# EAGLE design Spring12_6_daughterboard (EAGLE 6.1)
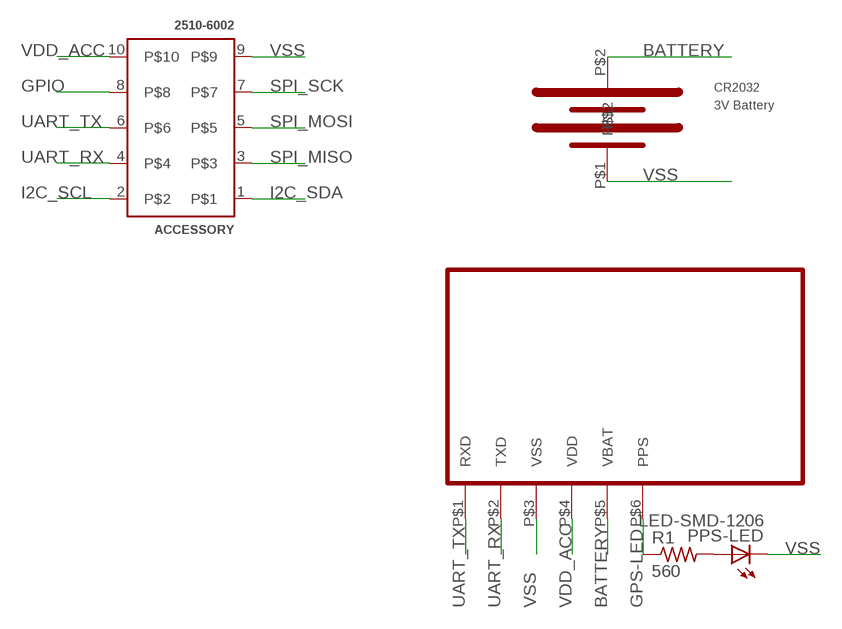
[diagram p0: schematic, sheet 1]

## Parts
ACCESSORY  2510-6002  [2510-6002]
PPS-LED  LED-SMD-1206  [LED1206]
R1  560  R-US_R1206  [R1206]
U$1  796136-1-CR2302_HOLDER  [796136-1-CR2032_HOLDER]
U$3  GPS-UP501  [GPS-UP501]

## Nets
BATTERY: U$1.P$2 U$3.P$5(VBAT)
GPIO: ACCESSORY.8
GPS-LED: R1.1 U$3.P$6(PPS)
I2C_SCL: ACCESSORY.2
I2C_SDA: ACCESSORY.1
N$1: PPS-LED.A R1.2
SPI_MISO: ACCESSORY.3
SPI_MOSI: ACCESSORY.5
SPI_SCK: ACCESSORY.7
UART_RX: ACCESSORY.4 U$3.P$2(TXD)
UART_TX: ACCESSORY.6 U$3.P$1(RXD)
VDD_ACC: ACCESSORY.10 U$3.P$4(VDD)
VSS: ACCESSORY.9 PPS-LED.C U$1.P$1 U$3.P$3(VSS)

## Library data of the parts
ACCESSORY = 4534_I2C2:2510-6002: 3M 2510-6002 Walled Header
PPS-LED = 4534_I2C2:LED-SMD-1206: 160-1169-1-ND
R1 = rcl:R-US_: RESISTOR, American symbol
U$1 = 4534_Node_Board:796136-1-CR2302_HOLDER
U$3 = 4534_Node_Board:GPS-UP501

## Board
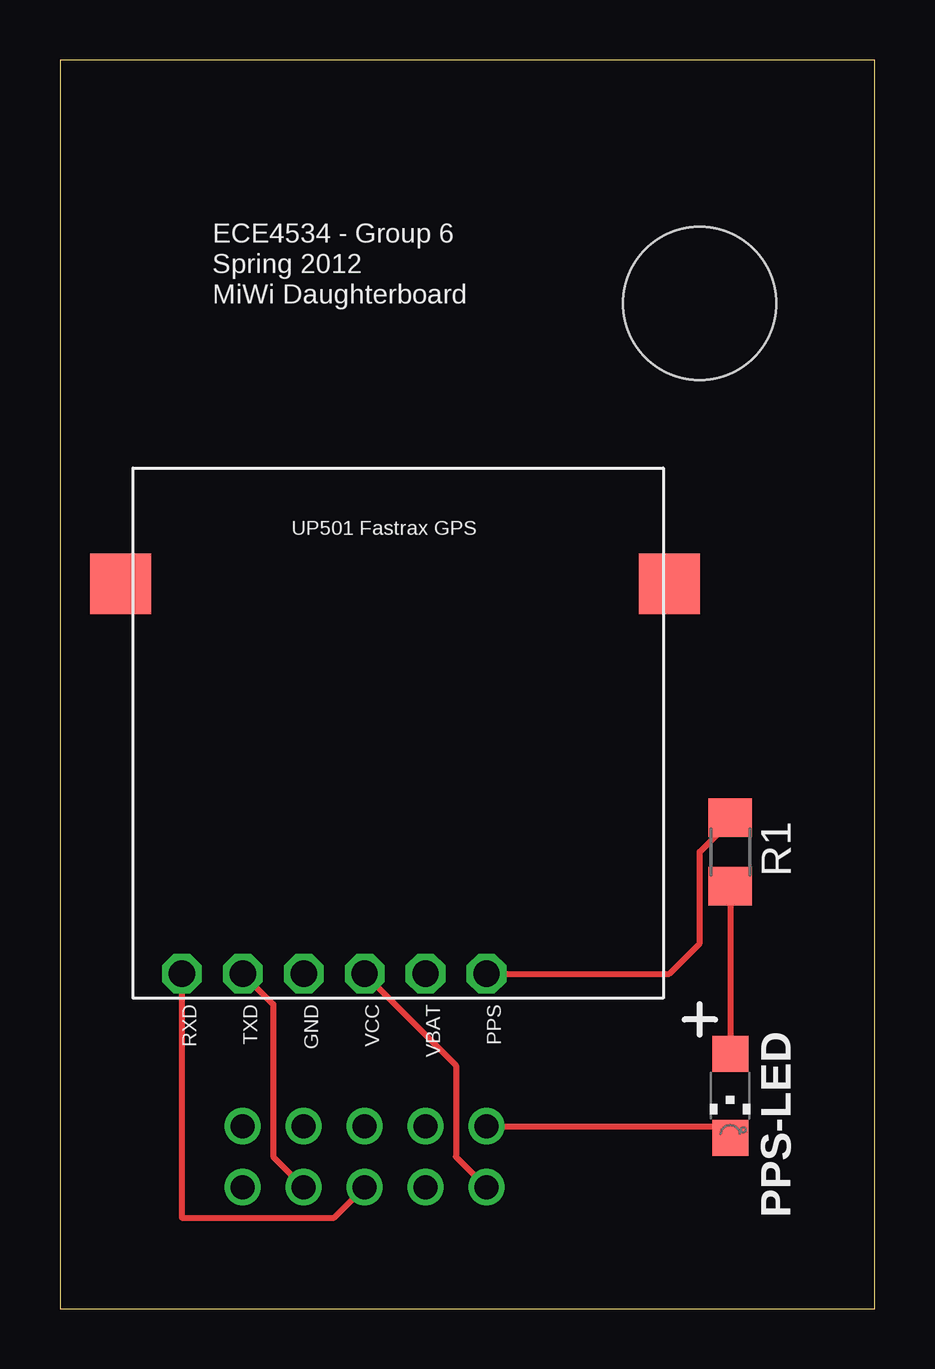
[diagram p1: board, top side]
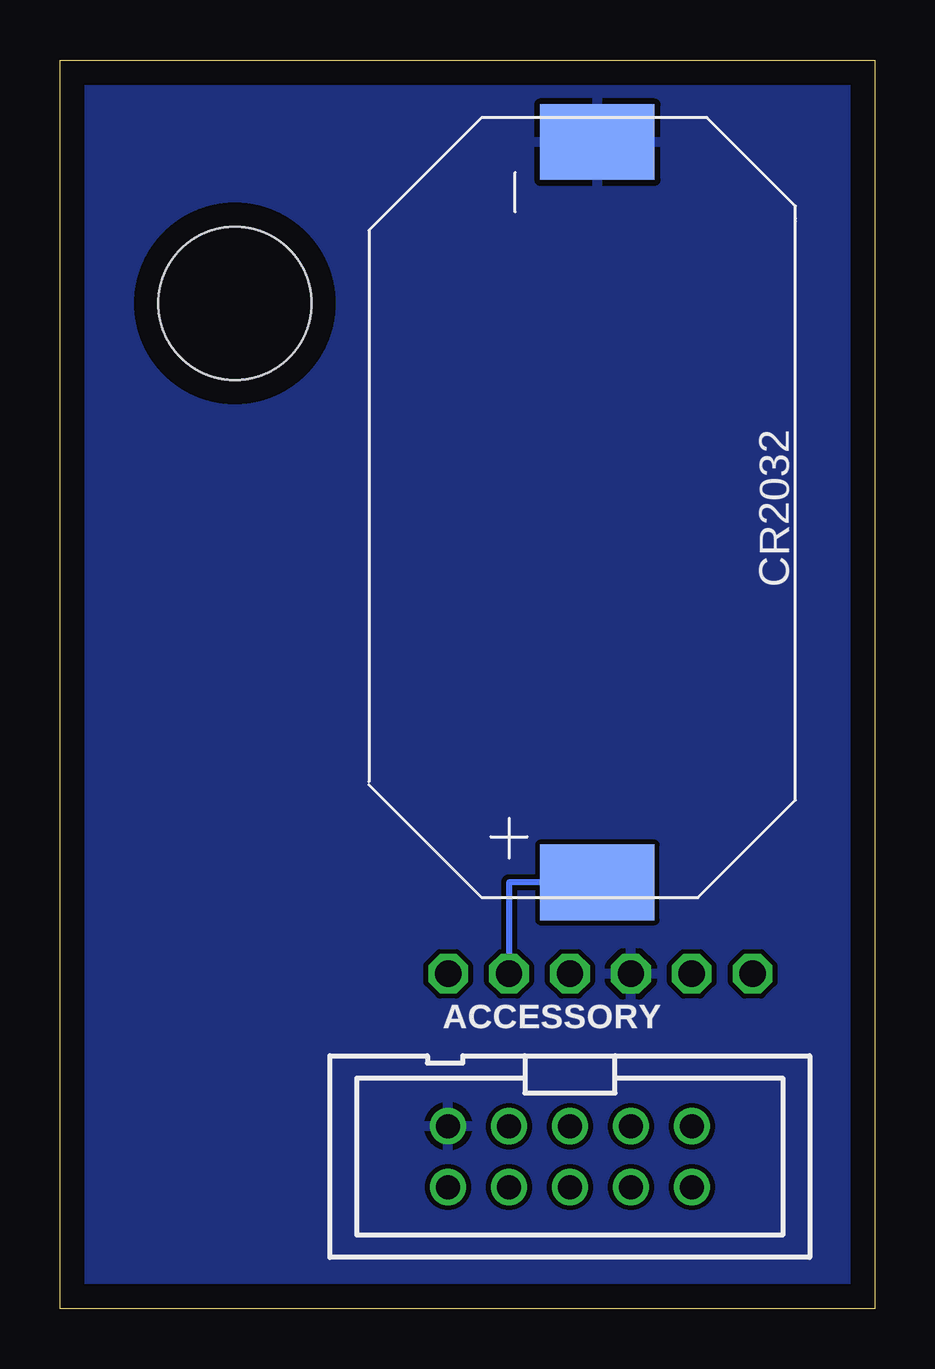
[diagram p2: board, bottom side, seen from below]

Size 33.96 x 52.06 mm. Coordinates in mm from the lower left corner, seen from the top.
Outline: 0,0 33.96,0 33.96,52.06 0,52.06 0,0
Copper layers (1*16): Top 0.035mm / dielectric 1.5mm / Bottom 0.035mm
Design rules: minimum track width 10mil, minimum drill 24mil, track to track 8mil, track to pad 8mil, pad to pad 8mil, via to via 8mil, smd to smd 8mil, copper to edge 40mil, drill to drill 8mil, minimum pad ring 10mil, minimum via ring 8mil, stop-mask expansion 4mil, vias tented up to drill 0mil, thermal gap 10mil
Holes 6.38 mm at 26.67,41.91
tRestrict: area 3.8,15.2 to 25.4,35.6

### Footprints (pad centres in the part's own frame; a part is rotated, then mirrored left to right if it is on the bottom)
2510-6002 = drill 1 pad 1.422: 1 -5.08,-1.27; 2 -5.08,1.27; 3 -2.54,-1.27; 4 -2.54,1.27; 5 0,-1.27; 6 0,1.27; 7 2.54,-1.27; 8 2.54,1.27; 9 5.08,-1.27; 10 5.08,1.27
LED1206 = smd 1.5 x 1.5: A 0,-1.75; C 0,1.75
R1206 = smd 1.6 x 1.803: 1 -1.422,0; 2 1.422,0
796136-1-CR2032_HOLDER = smd 3.15 x 4.775: P$1 20.701,-2.413; P$2 -10.16,-2.413
GPS-UP501 = drill 1.1 octagon: P$1 -7.62,-6.35; P$2 -5.08,-6.35; P$3 -2.54,-6.35; P$4 0,-6.35; P$5 2.54,-6.35; P$6 5.08,-6.35 | smd 2.54 x 2.54: P$7 -10.16,9.906; P$8 12.7,9.906

### Placement (x,y rotation side)
ACCESSORY  12.7,6.35 180 bottom
PPS-LED  27.94,8.89 180 top
R1  27.94,19.05 270 top
U$1  13.97,27.94 90 bottom
U$3  12.7,20.32 0 top

### Tracks (layer width: path | path; a pad name or v marks a point on that pad's centre or on a via)
BATTERY
  Bottom 0.254: U$3.P$5 15.24,17.78 U$1.P$2
GPS-LED
  Top 0.254: U$3.P$6 25.4,13.97 26.67,15.24 26.67,19.05 27.94,20.32 R1.1
N$1
  Top 0.254: 27.94,10.16 PPS-LED.A R1.2 27.94,17.78
UART_RX
  Top 0.254: ACCESSORY.4 8.89,6.35 8.89,12.7 U$3.P$2
UART_TX
  Top 0.254: ACCESSORY.6 11.43,3.81 5.08,3.81 U$3.P$1
VDD_ACC
  Top 0.254: ACCESSORY.10 16.51,6.35 16.51,10.16 U$3.P$4
VSS
  Top 0.254: ACCESSORY.9 27.94,7.62 PPS-LED.C
  pour Bottom: 0,52.07 34.29,52.07 34.29,0 0,0

### Text on the board
tPlace: ECE4534 - Group 6 | Spring 2012 | MiWi Daughterboard